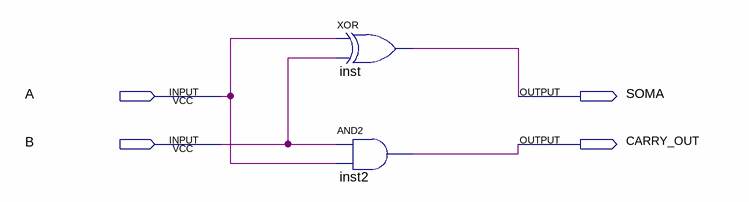
[diagram p0: schematic sheet]
// Quartus schematic somador.bdf as structural Verilog: 2 symbols, 4 pins
module somador (
  input  A,
  input  B,
  output SOMA,
  output CARRY_OUT
);

  xor inst (SOMA, A, B);
  and inst2 (CARRY_OUT, B, A);
endmodule
